# EAGLE design aufsatz_v2.3_usb (EAGLE 6.5.0)
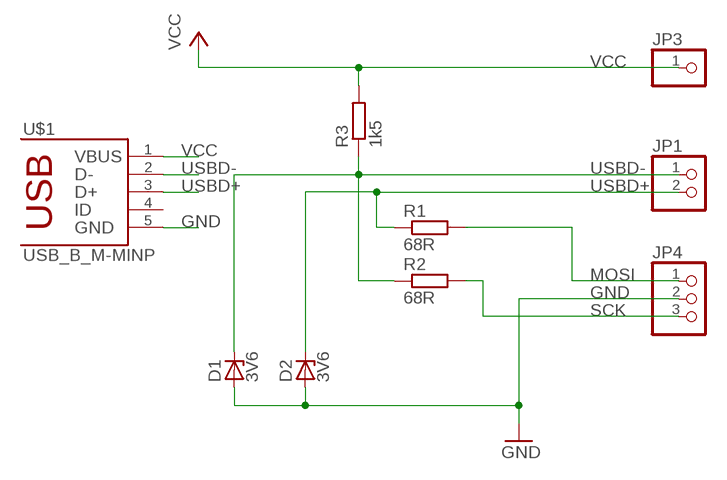
[diagram p0: schematic, sheet 1]

## Parts
D1  3V6  ZENER-DIODESOD80C  [SOD80C]
D2  3V6  ZENER-DIODESOD80C  [SOD80C]
JP1  PINHD-1X2  [1X02]
JP3  PINHD-1X1  [1X01]
JP4  PINHD-1X3  [1X03]
R1  68R  R-EU_R0805  [R0805]
R2  68R  R-EU_R0805  [R0805]
R3  1k5  R-EU_R0805  [R0805]
U$1  USB_B_M-MINP  [USB_B_MINI-PRINT]

## Nets
GND: D1.A D2.A JP4.2 U$1.5
MOSI: JP4.1 R1.2
SCK: JP4.3 R2.2
USBD+: D2.C JP1.2 R1.1 U$1.3
USBD-: D1.C JP1.1 R2.1 R3.1 U$1.2
VCC: JP3.1 R3.2 U$1.1
Unconnected: U$1.4

## Library data of the parts
D1 D2 = diode:ZENER-DIODE: Z-Diode
JP1 = pinhead:PINHD-1X2: PIN HEADER
JP3 = pinhead:PINHD-1X1: PIN HEADER
JP4 = pinhead:PINHD-1X3: PIN HEADER
R1-R3 = rcl:R-EU_: RESISTOR, European symbol
U$1 = n39:USB_B_M: USB 1.x and 2.x series "B" mini or micro plug; REICHELT: USB BWM

## Board
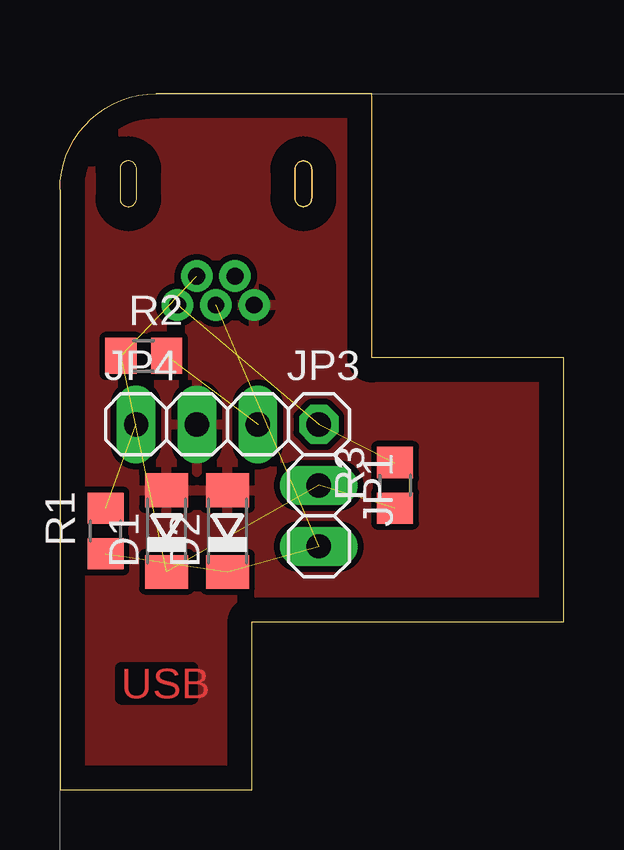
[diagram p1: board, top side]
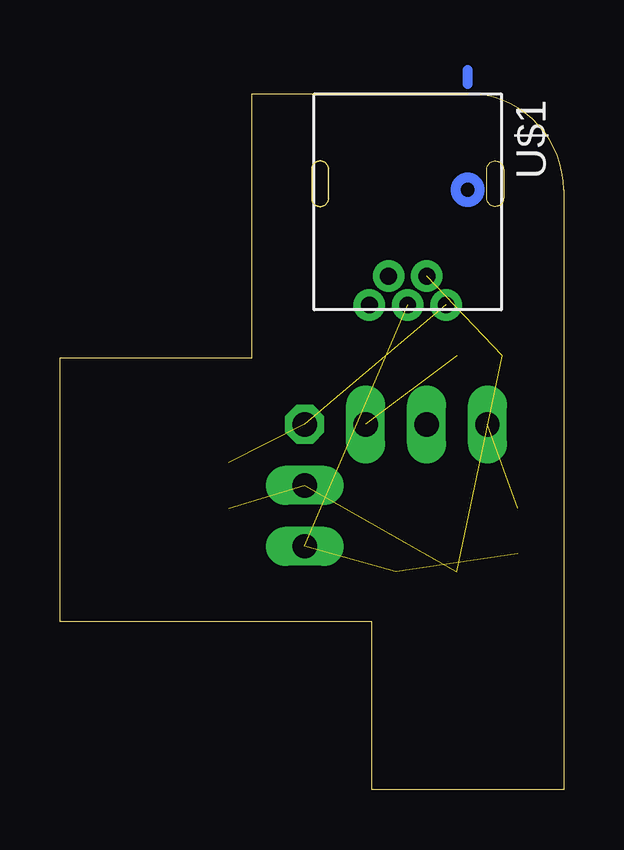
[diagram p2: board, bottom side, seen from below]

Size 21 x 29 mm. Coordinates in mm from the lower left corner, seen from the top.
Outline: 0,7 0,25 arc-90 4,29 13,29 13,18 21,18 21,7 8,7 8,0 0,0 0,6.97
Copper layers (1*16): Top 0.035mm / dielectric 1.5mm / Bottom 0.035mm
Design rules "starterkit_v2 *": minimum track width 12mil, minimum drill 0.8mm, track to track 10mil, track to pad 10mil, pad to pad 10mil, via to via 10mil, smd to smd 8mil, copper to edge 40mil, drill to drill 12mil, minimum pad ring 12mil, minimum via ring 12mil, stop-mask expansion 4mil, vias tented up to drill 0mil, thermal gap 10mil

### Footprints (pad centres in the part's own frame; a part is rotated, then mirrored left to right if it is on the bottom)
SOD80C = smd 1.4 x 1.8: A 1.7,0; C -1.7,0
1X02 = drill 1.016 long: 1 -1.27,0; 2 1.27,0
1X01 = drill 1.016 octagon: 1 0,0
1X03 = drill 1.016 long: 1 -2.54,0; 2 0,0; 3 2.54,0
R0805 = smd 1.3 x 1.5: 1 -0.95,0; 2 0.95,0
USB_B_MINI-PRINT = drill 0.7: 1 5.05,1.6; 2 3.85,0.8; 3 5.05,0; 4 3.85,-0.8; 5 5.05,-1.6

### Placement (x,y rotation side)
D1  4.45,10.78 90 top
D2  6.99,10.78 90 top
JP1  10.79,11.41 270 top
JP3  10.79,15.23 0 top
JP4  5.71,15.23 0 top
R1  1.91,10.78 90 top
R2  3.49,18.08 0 top
R3  13.97,12.68 90 top
U$1  6.5,25.25 270 bottom

### Tracks (layer width: path | path; a pad name or v marks a point on that pad's centre or on a via)
GND
  pour Top: 0,0.01 0,25 arc-90 4,29 21,29 21,0.01
MOSI  (1 unrouted)
N$1
  Bottom 0.406: 4,29.4 4,30
SCK  (1 unrouted)
USBD+  (3 unrouted)
USBD-  (4 unrouted)
VCC  (2 unrouted)
(copper drawn outside any net)
  shapes: Bottom circle x1

### Text on the board
Top: USB